# EAGLE design DRV8825_SHIELD_V2 (EAGLE 9.6.2)
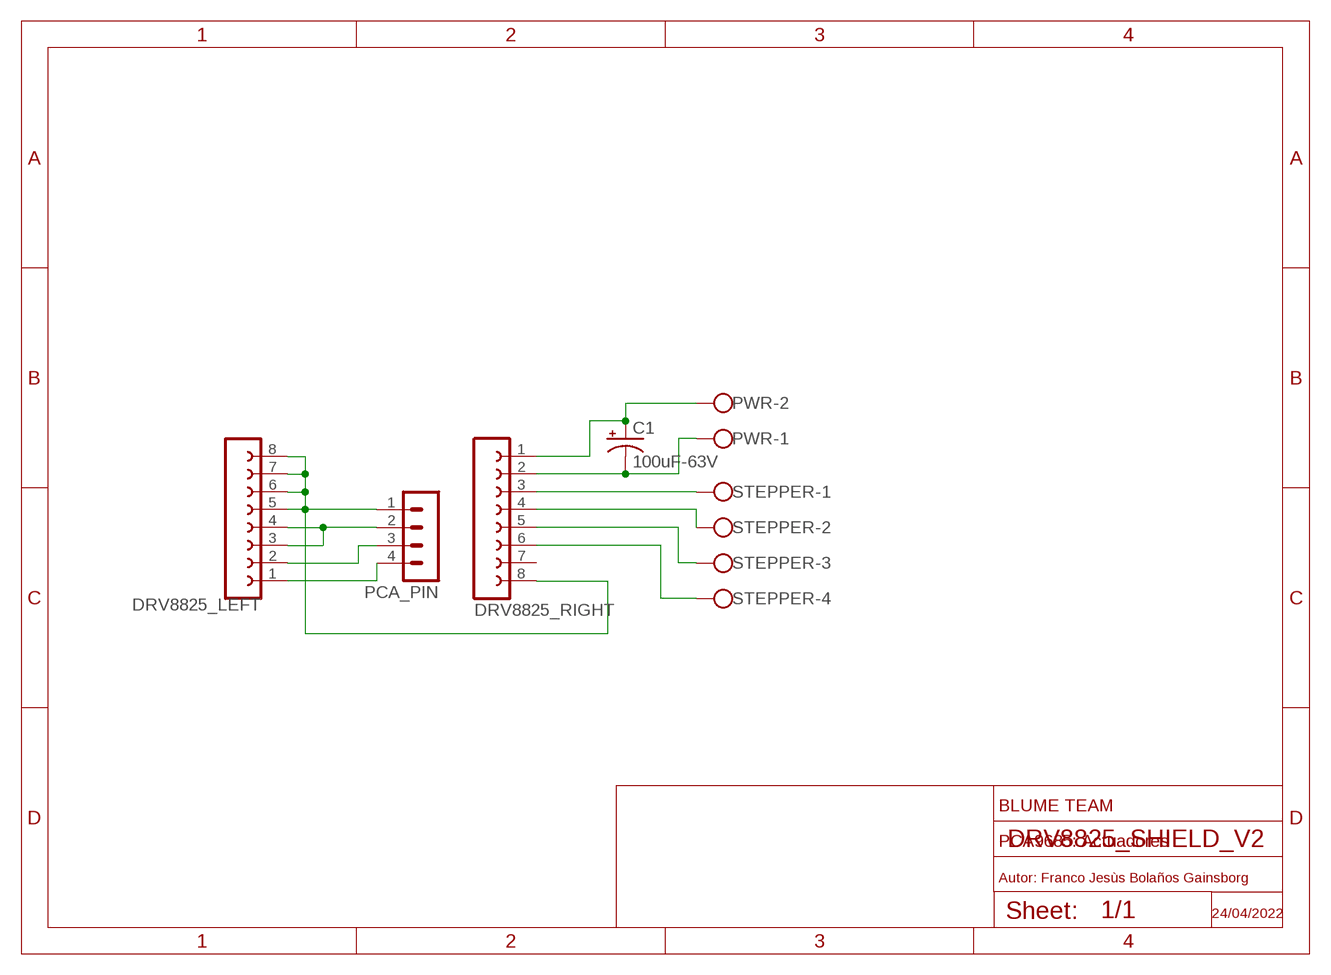
[diagram p0: schematic, sheet 1]

## Parts
C1  100uF-63V  CPOL-USE5-10.5  [E5-10,5]
DRV8825_LEFT  FE08-1  [FE08]
DRV8825_RIGHT  FE08-1  [FE08]
PCA_PIN  MA04-1  [MA04-1]
PWR  W237-102  [W237-102]
STEPPER  W237-4  [W237-4]

## Nets
N$1: DRV8825_RIGHT.3 STEPPER.1
N$2: DRV8825_RIGHT.4 STEPPER.2
N$3: DRV8825_LEFT.1 PCA_PIN.4
N$4: DRV8825_RIGHT.5 STEPPER.3
N$5: C1.+ DRV8825_RIGHT.1 PWR.2
N$6: C1.- DRV8825_RIGHT.2 PWR.1
N$7: DRV8825_LEFT.2 PCA_PIN.3
N$8: DRV8825_RIGHT.6 STEPPER.4
N$11: DRV8825_LEFT.5 DRV8825_LEFT.6 DRV8825_LEFT.7 DRV8825_LEFT.8 DRV8825_RIGHT.8 PCA_PIN.1
N$12: DRV8825_LEFT.3 DRV8825_LEFT.4 PCA_PIN.2
Unconnected: DRV8825_RIGHT.7

## Notes on the sheet
- BLUME TEAM
- PCA9685: Actuadores
- Autor: Franco Jesùs Bolaños Gainsborg
- 24/04/2022

## Library data of the parts
C1 = rcl:CPOL-US: POLARIZED CAPACITOR, American symbol; SPICEPREFIX: C
DRV8825_LEFT DRV8825_RIGHT = con-lsta:FE08-1: FEMALE HEADER; OC_FARNELL: unknown; OC_NEWARK: unknown
PCA_PIN = con-lstb:MA04-1: PIN HEADER; OC_FARNELL: unknown; OC_NEWARK: unknown
PWR = con-wago-500:W237-102: WAGO SCREW CLAMP; MPN: 237-102; OC_FARNELL: unknown; OC_NEWARK: 70K9898
STEPPER = con-wago-500:W237-4: WAGO SCREW CLAMP; OC_FARNELL: unknown; OC_NEWARK: unknown

## Board
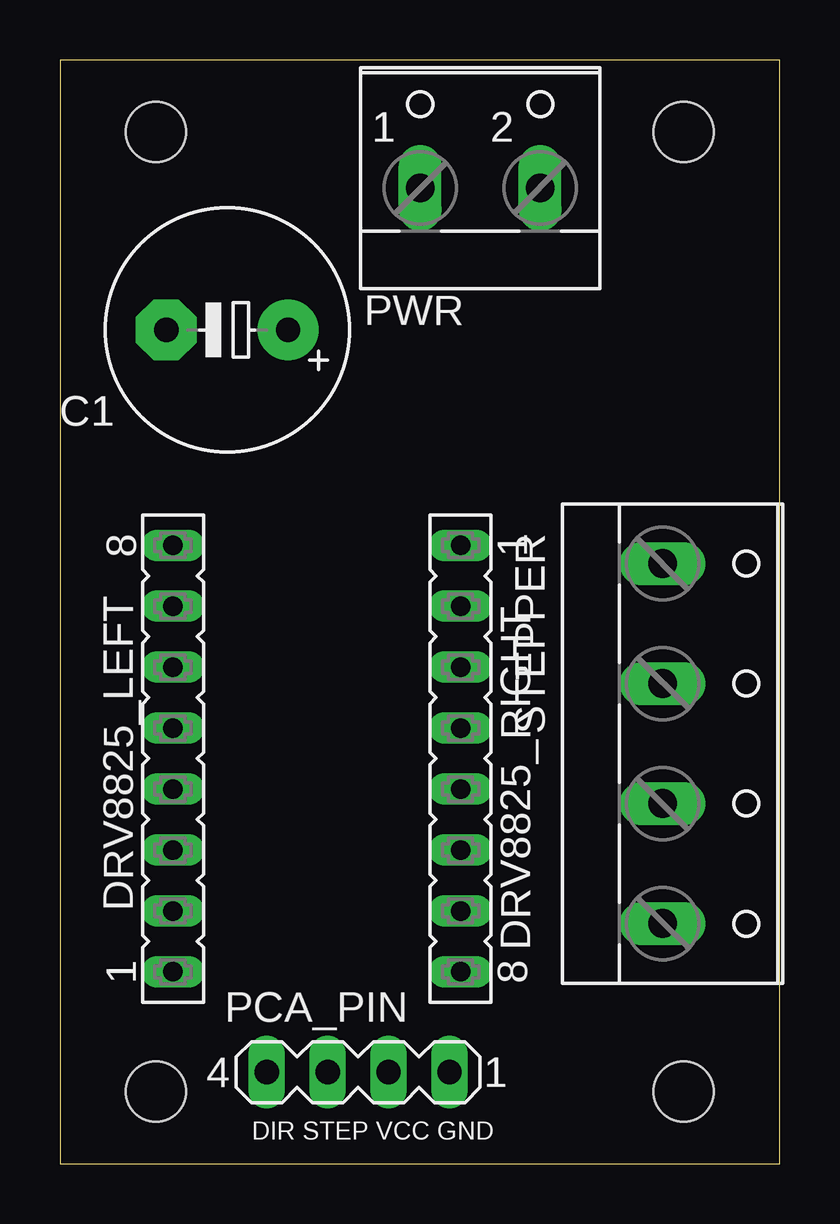
[diagram p1: board, top side]
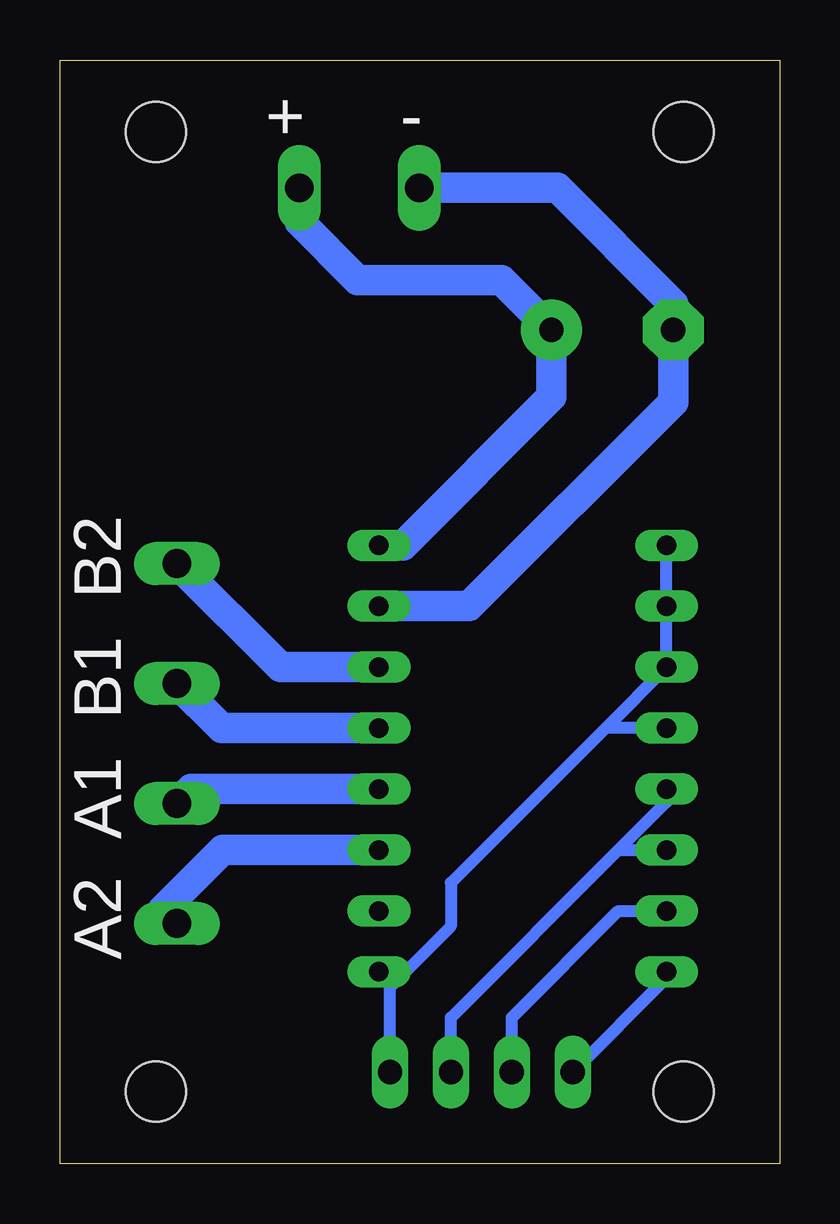
[diagram p2: board, bottom side, seen from below]

Size 30 x 46 mm. Coordinates in mm from the lower left corner, seen from the top.
Outline: 0,0 30,0 30,46 0,46 0,0
Copper layers (1*16): Top 0.035mm / dielectric 1.5mm / Bottom 0.035mm
Design rules "default": minimum track width 6mil, minimum drill 0.35mm, track to track 6mil, track to pad 6mil, pad to pad 6mil, via to via 6mil, smd to smd 6mil, copper to edge 40mil, drill to drill 6mil, minimum pad ring 10mil, minimum via ring 8mil, stop-mask expansion 4mil, vias tented up to drill 0mil, thermal gap 10mil
Holes 2.5 mm at 4,3 4,43 26,43 26,3

### Footprints (pad centres in the part's own frame; a part is rotated, then mirrored left to right if it is on the bottom)
E5-10,5 = drill 1.016 pad 2.54: + -2.54,0 | drill 1.016 pad 2.54 octagon: - 2.54,0
FE08 = drill 0.813 long: 1 -8.89,0; 2 -6.35,0; 3 -3.81,0; 4 -1.27,0; 5 1.27,0; 6 3.81,0; 7 6.35,0; 8 8.89,0
MA04-1 = drill 1.016 long: 1 -3.81,0; 2 -1.27,0; 3 1.27,0; 4 3.81,0
W237-102 = drill 1.194 long: 1 -2.5,-1.27; 2 2.5,-1.27
W237-4 = drill 1.194 long: 1 -7.5,-1.27; 2 -2.5,-1.27; 3 2.5,-1.27; 4 7.5,-1.27

### Placement (x,y rotation side)
C1  6.97,34.75 180 top
DRV8825_LEFT  4.71,16.88 90 top
DRV8825_RIGHT  16.7,16.88 270 top
PCA_PIN  12.43,3.81 180 top
PWR  17.52,41.94 0 top
STEPPER  26.4,17.51 270 top

### Tracks (layer width: path | path; a pad name or v marks a point on that pad's centre or on a via)
N$1
  Bottom 1.27: DRV8825_RIGHT.3 20.81,20.69 STEPPER.1
N$2
  Bottom 1.27: DRV8825_RIGHT.4 23.27,18.15 STEPPER.2
N$3
  Bottom 0.508: PCA_PIN.4 4.71,7.72 DRV8825_LEFT.1
N$4
  Bottom 1.27: DRV8825_RIGHT.5 24.53,15.61 STEPPER.3
N$5
  Bottom 1.27: DRV8825_RIGHT.1 15.7,25.77 9.51,31.96 C1.+ 11.59,36.83 17.59,36.83 20.02,39.26 PWR.2
N$6
  Bottom 1.27: PWR.1 9.27,40.67 4.43,35.83 C1.- 4.43,31.75 12.95,23.23 DRV8825_RIGHT.2
N$7
  Bottom 0.508: PCA_PIN.3 11.16,6.08 6.71,10.53 DRV8825_LEFT.2
N$8
  Bottom 1.27: DRV8825_RIGHT.6 23.22,13.07 25.7,10.59 STEPPER.4
N$11
  Bottom 0.508: DRV8825_LEFT.8 DRV8825_LEFT.7 DRV8825_LEFT.6 7.25,18.15 | 7.25,18.15 13.7,11.7 13.7,9.89 16.24,7.35 | DRV8825_LEFT.5 7.25,18.15 | PCA_PIN.1 16.24,7.35 | 16.24,7.35 16.24,7.53 DRV8825_RIGHT.8
N$12
  Bottom 0.508: PCA_PIN.2 13.7,6.08 6.71,13.07 | 6.71,13.07 DRV8825_LEFT.3 | 6.71,13.07 4.71,15.07 DRV8825_LEFT.4

### Text on the board
tPlace: DIR STEP VCC GND
bPlace: + - | A2 A1 B1 B2